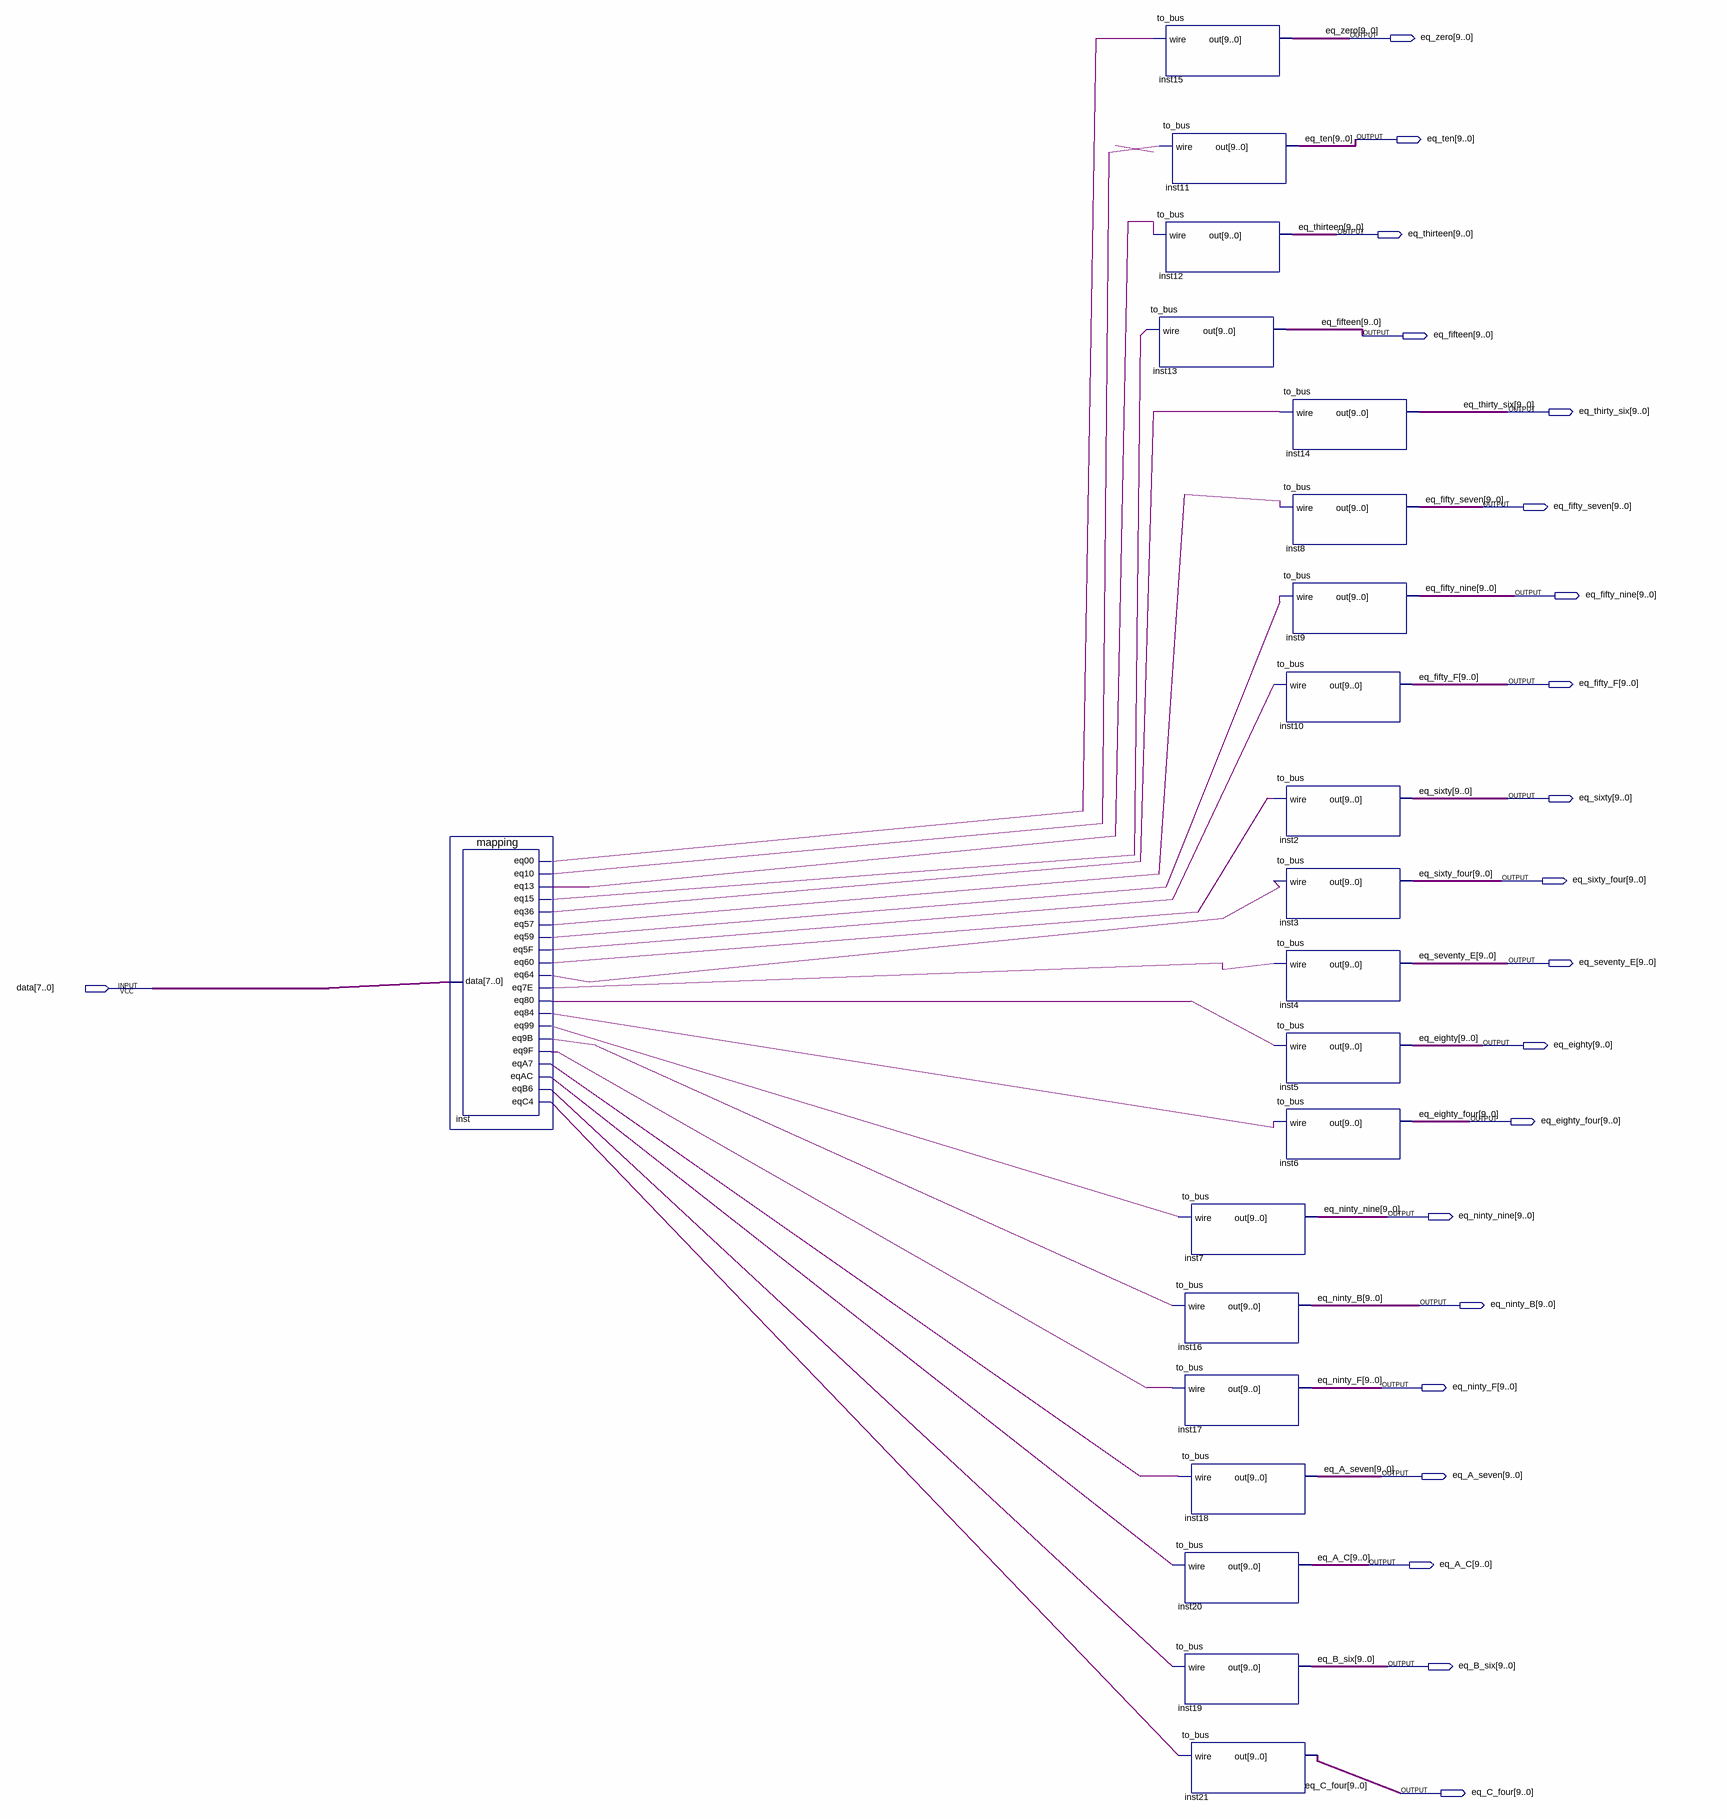
[diagram p0: schematic sheet]
// Quartus schematic mapp_dec.bdf as structural Verilog: 21 symbols, 21 pins
module mapp_dec (
  input  [7:0] data,
  output [9:0] eq_zero,
  output [9:0] eq_ten,
  output [9:0] eq_thirteen,
  output [9:0] eq_fifteen,
  output [9:0] eq_thirty_six,
  output [9:0] eq_fifty_seven,
  output [9:0] eq_fifty_nine,
  output [9:0] eq_fifty_F,
  output [9:0] eq_sixty,
  output [9:0] eq_sixty_four,
  output [9:0] eq_seventy_E,
  output [9:0] eq_eighty,
  output [9:0] eq_eighty_four,
  output [9:0] eq_ninty_nine,
  output [9:0] eq_ninty_B,
  output [9:0] eq_ninty_F,
  output [9:0] eq_A_seven,
  output [9:0] eq_A_C,
  output [9:0] eq_B_six,
  output [9:0] eq_C_four
);

  wire inst_eq00, inst_eq5f, inst_eq7e, inst_eq9b, inst_eq9f, inst_eq10, inst_eq13, inst_eq15, inst_eq36,
       inst_eq57, inst_eq59, inst_eq60, inst_eq64, inst_eq80, inst_eq84, inst_eq99, inst_eqa7, inst_eqac,
       inst_eqb6, inst_eqc4;

  mapping inst (
    .data(data), .eq00(inst_eq00), .eq10(inst_eq10), .eq13(inst_eq13), .eq15(inst_eq15), .eq36(inst_eq36),
    .eq57(inst_eq57), .eq59(inst_eq59), .eq5F(inst_eq5f), .eq60(inst_eq60), .eq64(inst_eq64),
    .eq7E(inst_eq7e), .eq80(inst_eq80), .eq84(inst_eq84), .eq99(inst_eq99), .eq9B(inst_eq9b),
    .eq9F(inst_eq9f), .eqA7(inst_eqa7), .eqAC(inst_eqac), .eqB6(inst_eqb6), .eqC4(inst_eqc4));
  to_bus inst15 (.\wire (inst_eq00), .out(eq_zero));
  to_bus inst11 (.\wire (inst_eq10), .out(eq_ten));
  to_bus inst12 (.\wire (inst_eq13), .out(eq_thirteen));
  to_bus inst13 (.\wire (inst_eq15), .out(eq_fifteen));
  to_bus inst7 (.\wire (inst_eq99), .out(eq_ninty_nine));
  to_bus inst16 (.\wire (inst_eq9b), .out(eq_ninty_B));
  to_bus inst17 (.\wire (inst_eq9f), .out(eq_ninty_F));
  to_bus inst18 (.\wire (inst_eqa7), .out(eq_A_seven));
  to_bus inst20 (.\wire (inst_eqac), .out(eq_A_C));
  to_bus inst19 (.\wire (inst_eqb6), .out(eq_B_six));
  to_bus inst21 (.\wire (inst_eqc4), .out(eq_C_four));
  to_bus inst14 (.\wire (inst_eq36), .out(eq_thirty_six));
  to_bus inst8 (.\wire (inst_eq57), .out(eq_fifty_seven));
  to_bus inst9 (.\wire (inst_eq59), .out(eq_fifty_nine));
  to_bus inst10 (.\wire (inst_eq5f), .out(eq_fifty_F));
  to_bus inst2 (.\wire (inst_eq60), .out(eq_sixty));
  to_bus inst3 (.\wire (inst_eq64), .out(eq_sixty_four));
  to_bus inst4 (.\wire (inst_eq7e), .out(eq_seventy_E));
  to_bus inst5 (.\wire (inst_eq80), .out(eq_eighty));
  to_bus inst6 (.\wire (inst_eq84), .out(eq_eighty_four));
endmodule
